# EasyEDA Pro project NU1680无线充电接收端底座.eprj, schematic 磁吸
Create Date: 2024-03-03; Page Name: P1; Project Name: NU1680无线充电接收端底座; Schematic Name: 磁吸; Update Date: 2024-03-08; Company: 嘉立创EDA; Page Size: A4; Version: V1.0
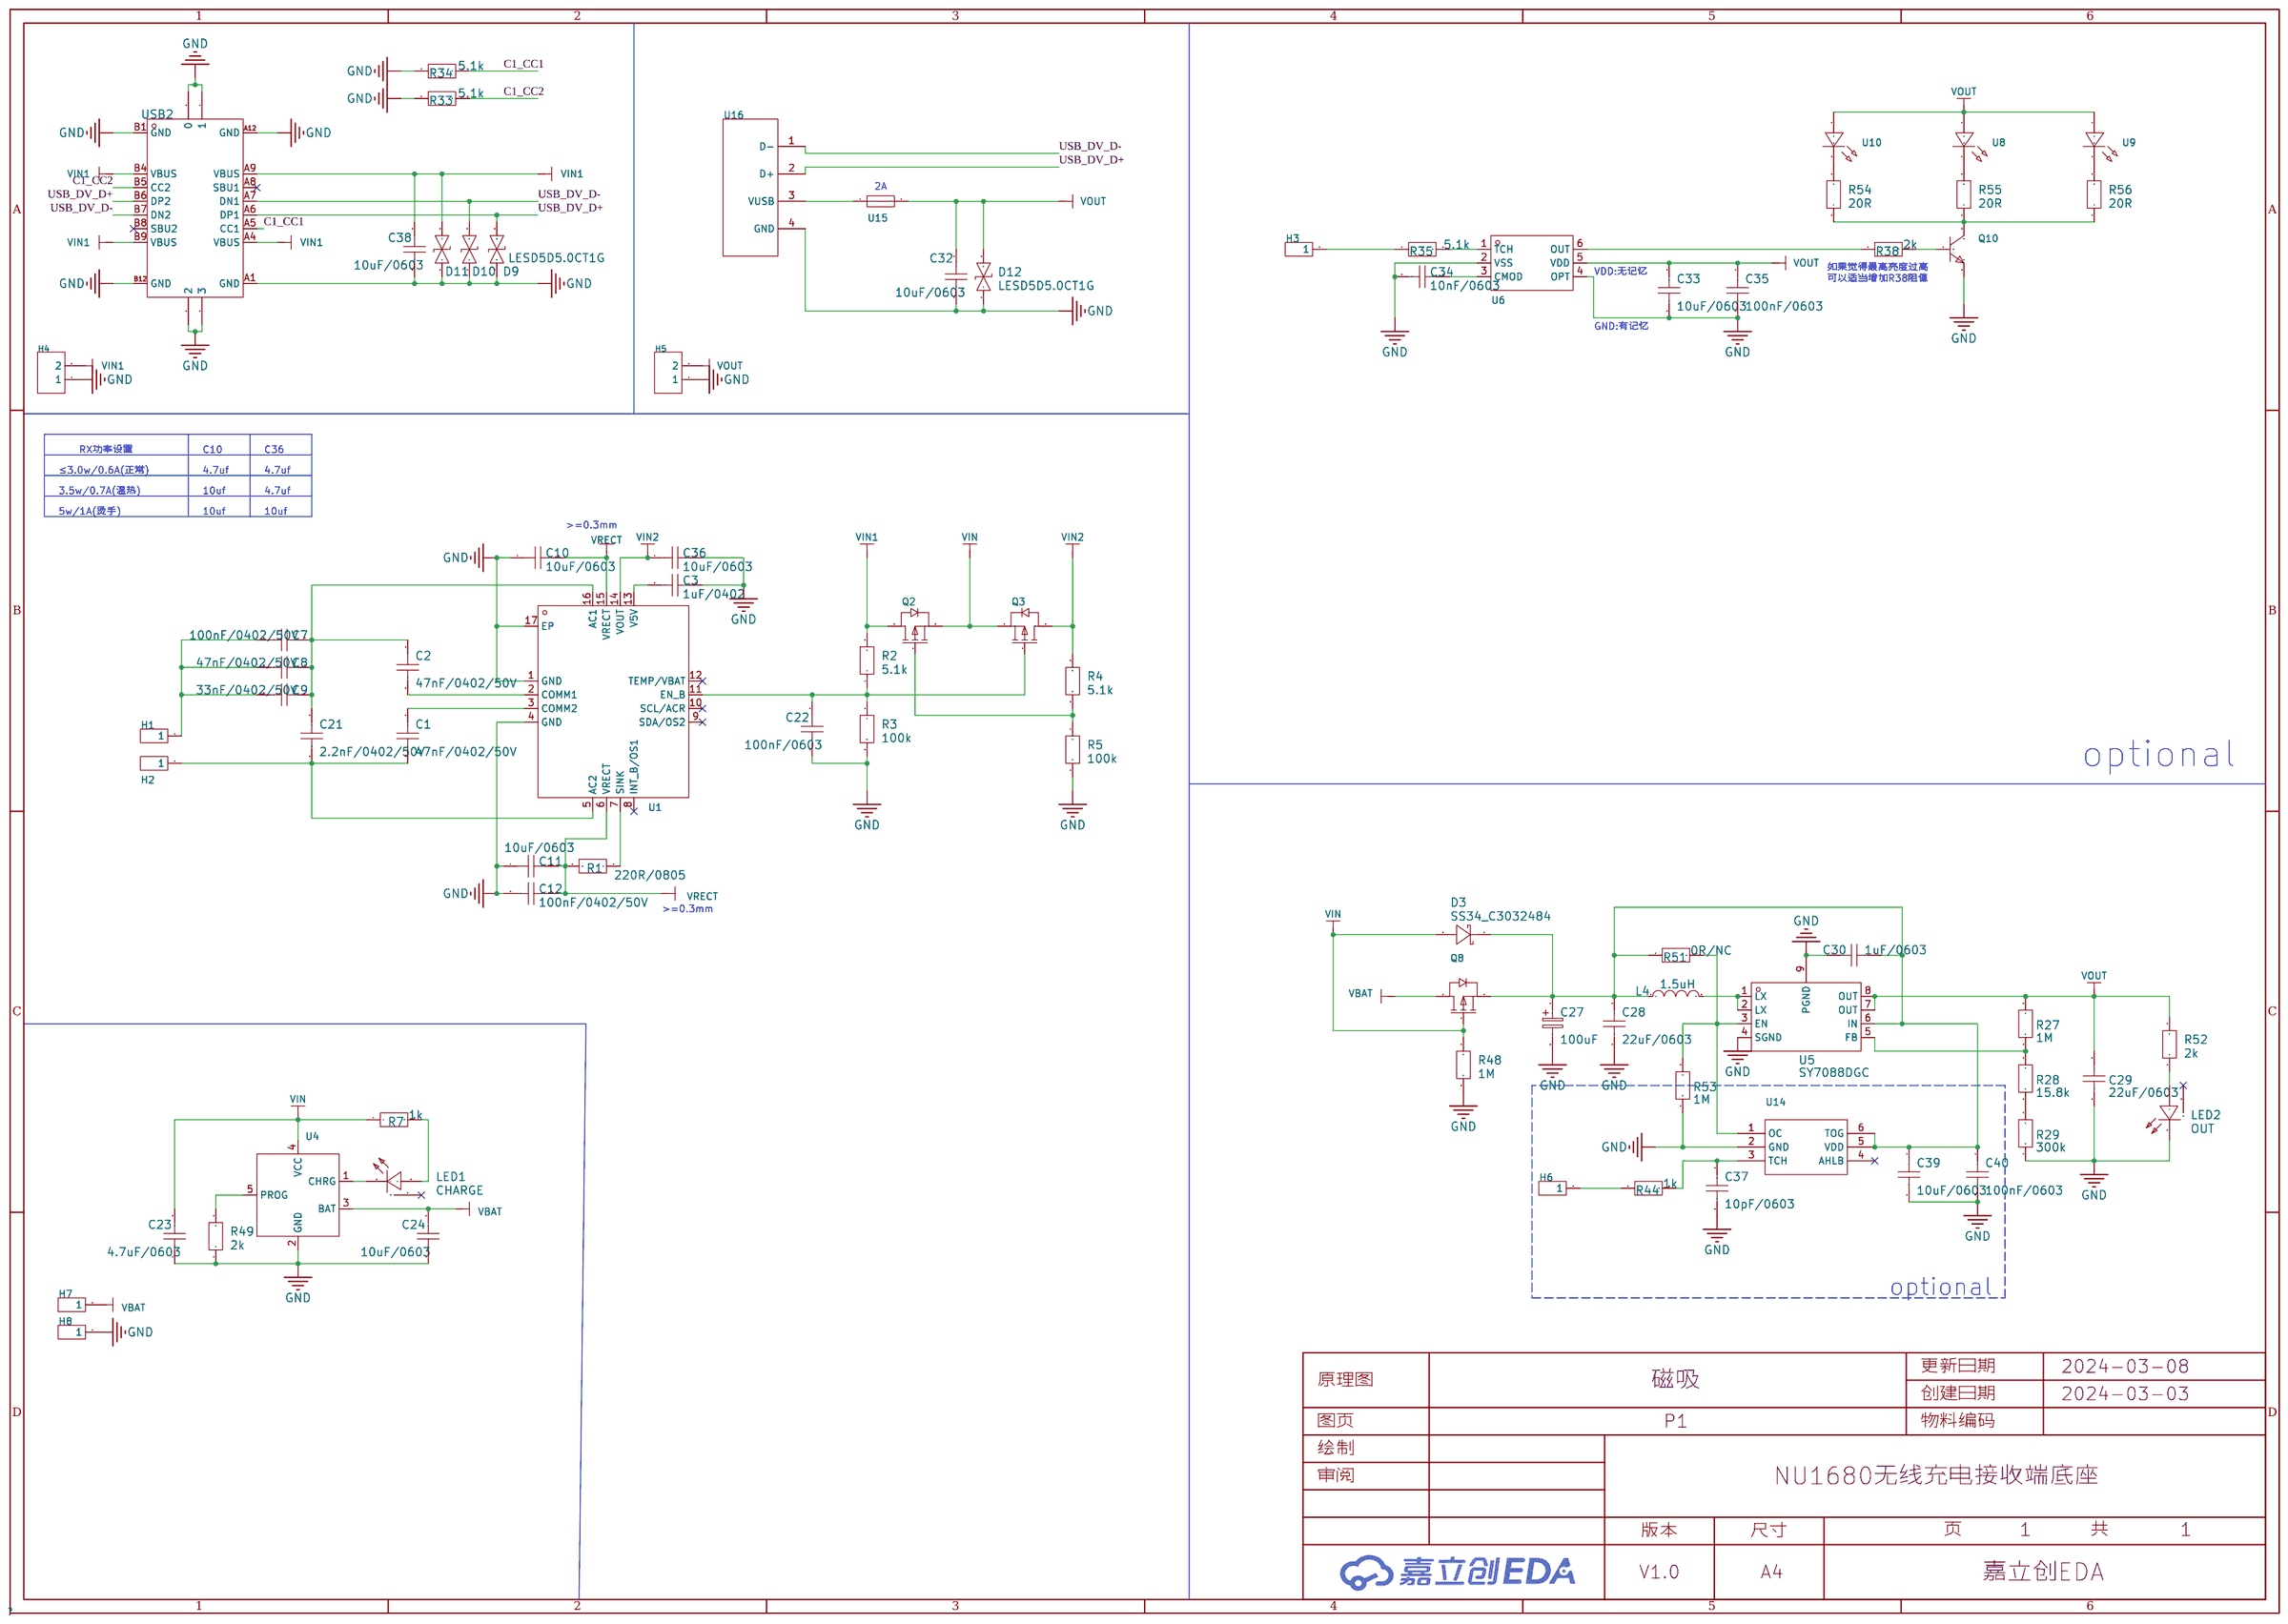
[diagram p0: schematic sheet]

## Parts
C1  47nF/0402/50V  [C0402]
C2  47nF/0402/50V  [C0402]
C3  1uF/0402  [C0402]
C7  100nF/0402/50V  [C0402]
C8  47nF/0402/50V  [C0402]
C9  33nF/0402/50V  [C0402]
C10  10uF/0603  [C0603]
C11  10uF/0603  [C0603]
C12  100nF/0402/50V  [C0402]
C21  2.2nF/0402/50V  [C0402]
C22  100nF/0603  [C0603]
C23  4.7uF/0603  [C0603]
C24  10uF/0603  [C0603]
C27  100uF  [CAP-SMD_L3.5-W2.8]
C28  22uF/0603  [C0603]
C29  22uF/0603  [C0603]
C30  1uF/0603  [C0603]
C32  10uF/0603  [C0603]
C33  10uF/0603  [C0603]
C34  10nF/0603  [C0603]
C35  100nF/0603  [C0603]
C36  10uF/0603  [C0603]
C37  10pF/0603  [C0603]
C38  10uF/0603  [C0603]
C39  10uF/0603  [C0603]
C40  100nF/0603  [C0603]
D3  SS34_C3032484  [SMA_L4.3-W2.6-LS5.2-RD]
D9  LESD5D5.0CT1G  [SOD-523_L1.2-W0.8-LS1.6-BI]
D10  LESD5D5.0CT1G  [SOD-523_L1.2-W0.8-LS1.6-BI]
D11  LESD5D5.0CT1G  [SOD-523_L1.2-W0.8-LS1.6-BI]
D12  LESD5D5.0CT1G  [SOD-523_L1.2-W0.8-LS1.6-BI]
H1  2.54-1*1P针  [2mm-1.3mm孔]  (no BOM)
H2  2.54-1*1P针  [2mm-1.3mm孔]  (no BOM)
H3  2.54-1*1P针  [2mm-1.3mm孔]  (no BOM)
H4  -  [HDR-TH_2P-P2.54-V-F]  (no BOM)
H5  -  [HDR-TH_2P-P2.54-V-F]  (no BOM)
H6  2.54-1*1P针  [2mm-1.3mm孔]  (no BOM)
H7  2.54-1*1P针  [2mm-1.3mm孔]  (no BOM)
H8  2.54-1*1P针  [2mm-1.3mm孔]  (no BOM)
L4  1.5uH  [IND-SMD_L2.5-W2.0_MHCD252012A]
LED1  CHARGE  [LED-SMD_L3.2-W1.0-R-RD]
LED2  OUT  [LED-SMD_L3.2-W1.0-R-RD]
Q2  DMG2305UX-7  [SOT-23-3_L2.9-W1.3-P1.90-LS2.4-BR]
Q3  DMG2305UX-7  [SOT-23-3_L2.9-W1.3-P1.90-LS2.4-BR]
Q8  DMG2305UX-7  [SOT-23-3_L2.9-W1.3-P1.90-LS2.4-BR]
Q10  S8050  [SOT-23-3_L2.9-W1.3-P1.90-LS2.4-BR]
R1  220R/0805  [R0805]
R2  5.1k  [R0603]
R3  100k  [R0603]
R4  5.1k  [R0603]
R5  100k  [R0603]
R7  1k  [R0603]
R27  1M  [R0603]
R28  15.8k  [R0603]
R29  300k  [R0603]
R33  5.1k  [R0603]
R34  5.1k  [R0603]
R35  5.1k  [R0603]
R38  2k  [R0603]
R44  1k  [R0603]
R48  1M  [R0603]
R49  2k  [R0603]
R51  0R/NC  [R0402]
R52  2k  [R0603]
R53  1M  [R0603]
R54  20R  [R0603]
R55  20R  [R0603]
R56  20R  [R0603]
U1  NU1680  [QFN-16_L3.0-W3.0-P0.50-TL-EP1.9]
U4  TP4054  [TSOT-23-5_L2.9-W1.6-P0.95-LS2.8-BR]
U5  SY7088DGC  [DFN-8_L3.0-W2.0-P0.50-BL-EP]
U6  6021WS  [SOT-23-6_L2.9-W1.6-P0.95-LS2.8-BR]
U8  -  [3V 24MM LED S]
U9  -  [3V 24MM LED S]
U10  -  [3V 24MM LED S]
U14  RH6015C  [SOT-23-6_L2.9-W1.6-P0.95-LS2.8-BR]
U15  TLC-NSMD100  [F1206]
U16  -  [螺旋磁吸充电公座4P]
USB2  TYPE-C-31-M-12  [USB-C_SMD-TYPE-C-31-M-12]

## Library data of the parts
C1-C3 C7-C12 C21-C24 C32-C40 = 10uF
C27 = F931A107KBAAHA: Supplier: LCSC; Supplier Part: C304232; Manufacturer: Kyocera AVX; JLCPCB Part Class: Extended Part
C28 C29 = 22uF
C30 = 1uF
D3 = SS34: Supplier: LCSC; Supplier Part: C3032484; Manufacturer: TDD(台冠电子); JLCPCB Part Class: Extended Part
D9-D12 = LESD5D5.0CT1G: Supplier: LCSC; Supplier Part: C383211; Manufacturer: LRC(乐山无线电); JLCPCB Part Class: Extended Part
H1-H3 H6-H8 = 2.54-1*1P针: 排数:单排;总PIN位数:1P;间距:-;插针结构:-;行距:-;安装类型:直插;圆针/方针:-;额定电流:-;额定电压:-;配合针长度:-;塑高:-;触头材质:-;触头镀层:-;颜色:黑色;; LCSC Part Name: 直插; Supplier Part: C81276; Manufacturer: BOOMELE(博穆精密); Supplier Footprint: 插件,P=2.54mm; JLCPCB Part Class: Extended Part; Datasheet: https://atta.szlcsc.com/upload/public/pdf/source/20221018/3E9408392E35E6F57A28985E5F7BF5C9.pdf; Supplier: LCSC; Number of Rows: 单排; Number of Pins: 1P; Mounting Type: 直插; Color: 黑色
H4 H5 = HDR-F_2.54_1x2P: Supplier Part: C49661; Supplier Footprint: 插件
L4 = MHCD252012A-1R5M-A8S: Supplier: LCSC; Supplier Part: C285767; Manufacturer: chilisin(奇力新); JLCPCB Part Class: Extended Part
LED1 LED2 = E6C1204QBAC1UDA: Supplier: LCSC; Supplier Part: C375481; Manufacturer: EKINGLUX; JLCPCB Part Class: Extended Part
Q2 Q3 Q8 = DMG2305UX-7: 类型:P沟道;漏源电压(Vdss):20V;连续漏极电流(Id):4.2A;功率(Pd):1.4W;导通电阻(RDS(on)@Vgs,Id):52mΩ@4.5V,4.2A;; LCSC Part Name: P沟道 20V 4.2A; Supplier Part: C150470; Manufacturer: DIODES(美台); Supplier Footprint: SOT-23; Datasheet: https://atta.szlcsc.com/upload/public/pdf/source/20171221/C150470_15138312285201195465.pdf; Supplier: LCSC; Type: P沟道; Drain Source Voltage (Vdss): 20V; Continuous Drain Current (Id): 4.2A; Power Dissipation (Pd): 1.4W; Drain Source On Resistance (RDS(on)@Vgs,Id): 52mΩ@4.5V,4.2A; Gate Threshold Voltage (Vgs(th)@Id): 900mV@250uA; Total Gate Charge (Qg@Vgs): 10.2nC@4.5V; Input Capacitance (Ciss@Vds): 808pF@15V; Operating Temperature: -55℃~+150℃@(Tj)
Q10 = S8050_C2891804: 晶体管类型:NPN;集电极电流(Ic):500mA;集射极击穿电压(Vceo):25V;功率(Pd):300mW;; LCSC Part Name: NPN 电流:500mA 耐压:25V; Supplier Part: C2891804; Manufacturer: YONGYUTAI(永裕泰); Supplier Footprint: SOT-23; Datasheet: https://atta.szlcsc.com/upload/public/pdf/source/20210901/5347316A10609C628D4D69AE01446E5B.pdf; Supplier: LCSC; Transistor Type: NPN; Collector Current (Ic): 500mA; Collector-Emitter Breakdown Voltage (Vceo): 25V; Power Dissipation (Pd): 300mW; Collector Cut-Off Current (Icbo): 1uA; Collector-Emitter Saturation Voltage (VCE(sat)@Ic,Ib): 500mV@500mA,50mA
R1-R5 R7 R33-R35 R38 R44 R49 R51 R52 R54-R56 = 4.7k
R27 R48 R53 = 1M
R28 = 15.8k
R29 = 300k
U1 = NU1680: Supplier Part: C9900015597; Supplier Footprint: QFN-16; JLCPCB Part Class: 扩展库; Datasheet: https://atta.szlcsc.comnull; Supplier: LCSC
U4 = TP4054_C668215: 电源电压:6.5V;最大充电电流:500mA;电池类型:锂离子/聚合物;电池节数:1;; Supplier: LCSC; Supplier Part: C668215; Manufacturer: UMW(友台半导体); Supplier Footprint: SOT-23-5L; Datasheet: https://atta.szlcsc.com/upload/public/pdf/source/20231109/1E60770826C4E1A0E5898BBC08FF3A57.pdf; Supply Voltage: 6.5V; Maximum Charge Current: 500mA; Type of Battery: 锂离子/聚合物; Number of Cells: 1; Operating Temperature: -40℃~+85℃
U5 = SY7088DGC: Supplier: LCSC; Supplier Part: C178240; Manufacturer: silergy(矽力杰); JLCPCB Part Class: Extended Part
U6 = 6021WS: 台灯无极调光芯片; LCSC Part Name: 台灯无极调光芯片; Supplier Part: C2998018; Manufacturer: Sam&amp;wing(芯网); Supplier Footprint: SOT-23-6; JLCPCB Part Class: Extended Part; Datasheet: https://atta.szlcsc.com/upload/public/pdf/source/20220413/D829B175424EE2F17DF481E76DE083FC.pdf; Supplier: LCSC; Check: false
U8-U10 = 3V 24MM LED
U14 = RH6015C: 通道数:1;芯片功能:电容式触摸;是否自锁:否;; Supplier Part: C78180; Manufacturer: RONGHE(融和); Supplier Footprint: SOT-23-6; Datasheet: https://atta.szlcsc.com/upload/public/pdf/source/20180817/C78180_E4E9444B91B4959CB61DC2F6C2FF41BB.pdf; Supplier: LCSC; The Channel Number: 1; Chip Function: 电容式触摸; Whether the Lock: 否; Operating Voltage: 2.3V~5.5V; Operating Current: 5uA; Operating Temperature: -20℃~+85℃
U15 = TLC-NSMD100: 最大电压:6V;最大电流:100A;保持电流:1A;跳闸电流:2A;; LCSC Part Name: 6V 1A 1206自恢复; Supplier Part: C261954; Manufacturer: TLC(竞沃); Supplier Footprint: 1206; Datasheet: https://atta.szlcsc.com/upload/public/pdf/source/20180802/C261957_E25258C63D2572D4B5DAC4246B729F01.pdf; Supplier: LCSC; Operating Voltage (Max): 6V; Current Rating (Max): 100A; Hold Current: 1A; Trip Current: 2A; Power Dissipation: 600mW; Maximum Time to Trip: 100ms; Operating Temperature: -40℃~+85℃
U16 = 螺旋磁吸充电公座4P
USB2 = TYPE-C-31-M-12: 连接器类型:Type-C;标准:-;公母:母;触点数量:16P;端口数量:1;安装方式:-;额定电流 - 电源:5A;触头材质:-;触头镀层:-;工作温度范围:-;焊接温度(最大值):-;; LCSC Part Name: Type-C 母; Supplier Part: C165948; Manufacturer: 韩国韩荣; Supplier Footprint: SMD; JLCPCB Part Class: Extended Part; Datasheet: https://atta.szlcsc.com/upload/public/pdf/source/20220525/466408E853115E789EDB0DDC29077C05.pdf; Supplier: LCSC; Connector Type: Type-C; Gender: 母; Number of Contacts: 16P; Number of Ports: 1; Current Rating - Power (Max): 5A

## Nets
GND: C3.1 C10.1 C11.1 C12.2 C22.1 C23.1 C24.1 C27.2 C28.2 C29.2 C30.1 C32.2 C33.2 C34.2 C35.2 C36.2 C37.2 C38.2 C39.2 C40.2 D9.1 D10.1 D11.1 D12.1 H4.1 H5.1 H8.1 LED2.2(-) Q10.2(E) R3.2 R5.2 R29.1 R33.2 R34.2 R48.2 R49.1 R53.1 U1.1(GND) U1.4(GND) U1.17(EP) U4.2(GND) U5.4(SGND) U5.9(PGND) U6.2(VSS) U6.4(OPT) U14.2(GND) U16.4(GND) USB2.0 USB2.1 USB2.2 USB2.3 USB2.A1(GND) USB2.A12(GND) USB2.B1(GND) USB2.B12(GND)
VBAT: C24.2 H7.1 Q8.3(D) U4.3(BAT)
VIN: C23.2 D3.2(A) Q2.2(S) Q3.2(S) Q8.1(G) R7.1 R48.1 U4.4(VCC)
VIN1: C38.1 D11.2 H4.2 Q2.3(D) R2.2 USB2.A4(VBUS) USB2.A9(VBUS) USB2.B4(VBUS) USB2.B9(VBUS)
VIN2: C36.1 Q3.3(D) R4.2 U1.14(VOUT)
C1_CC1: R34.1 USB2.A5(CC1)
C1_CC2: R33.1 USB2.B5(CC2)
USB_DV_D+: D9.2 U16.2(D+) USB2.A6(DP1) USB2.B6(DP2)
USB_DV_D-: D10.2 U16.1(D-) USB2.A7(DN1) USB2.B7(DN2)
VOUT: C29.1 C32.1 C33.1 C35.1 D12.2 H5.2 R27.2 R52.2 U5.7(OUT) U5.8(OUT) U6.5(VDD) U8.1 U9.1 U10.1 U15.2
VRECT: C10.2 C11.2 C12.1 R1.2 U1.6(VRECT) U1.15(VRECT)
$1N670: C2.2 U1.2(COMM1)
$1N673: C1.1 U1.3(COMM2)
$1N722: C7.2 C8.2 C9.2 H1.1
$1N847: C1.2 C21.2 H2.1 U1.5(AC2)
$1N854: C2.1 C7.1 C8.1 C9.1 C21.1 U1.16(AC1)
$1N972: C3.2 U1.13(V5V)
$1N1319: R1.1 U1.7(SINK)
$1N1795: Q2.1(G) R4.1 R5.1
$1N2387: R49.2 U4.5(PROG)
$1N2482: LED1.1(+) R7.2
$1N2485: LED1.2(-) U4.1(CHRG)
$1N2905: L4.2 U5.1(LX) U5.2(LX)
$1N2909: R27.1 R28.2 U5.5(FB)
$1N2915: R28.1 R29.2
$1N6971: R35.2 U6.1(TCH)
$1N6996: C34.1 U6.3(CMOD)
$1N8291: H3.1 R35.1
$1N8729: R38.1 U6.6(OUT)
$1N8745: Q10.1(B) R38.2
$1N9112: C22.2 Q3.1(G) R2.1 R3.1 U1.11(EN_B)
$1N12385: H6.1 R44.2
$1N12389: C37.1 R44.1 U14.3(TCH)
$1N13075: Q10.3(C) R54.1 R55.1 R56.1
$1N13108: R51.2 R53.2 U5.3(EN) U14.1(OC)
$1N13189: LED2.1(+) R52.1
$1N13550: R54.2 U10.2
$1N13622: R55.2 U8.2
$1N13646: R56.2 U9.2
$1N20771: U15.1 U16.3(VUSB)
$1N27060: C27.1 C28.1 C30.2 C39.1 C40.1 D3.1(K) L4.1 Q8.2(S) R51.1 U5.6(IN) U14.5(VDD) U14.6(TOG)

Not connected (* = marked no-connect by the designer): LED1 3*; LED2 3*; U1 8(INT_B/OS1)* 9(SDA/OS2)* 10(SCL/ACR)* 12(TEMP/VBAT)*; U14 4(AHLB)*; USB2 A8(SBU1)* B8(SBU2)*

## Notes on the sheet
- 2A
- VDD:无记忆
- 如果觉得最高亮度过高
  可以适当增加R38阻值
- GND:有记忆
- RX功率设置
- C10
- C36
- ≤3.0w/0.6A(正常)
- 4.7uf
- 4.7uf
- 3.5w/0.7A(温热)
- 10uf
- 4.7uf
- 5w/1A(烫手)
- 10uf
- 10uf
- >=0.3mm
- optional
- >=0.3mm
- optional
